# Altium schematic sheet v1.0.SchDoc
size 101 x 76 mm
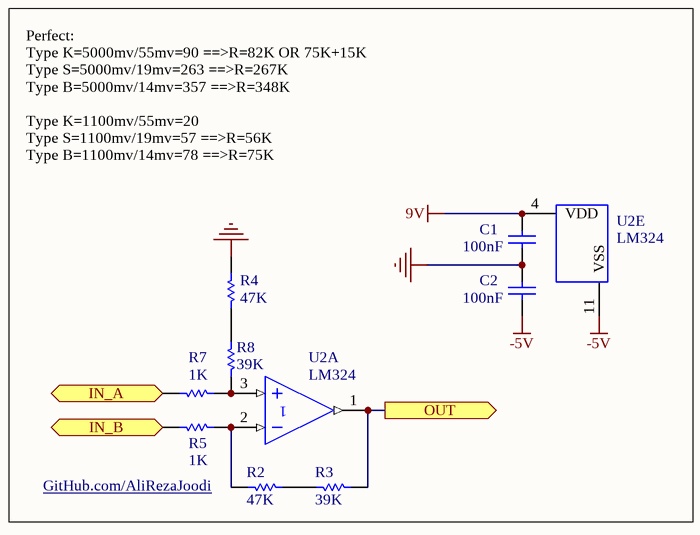
[diagram p0: v1.0.SchDoc]

## Parts
C1  100nF  [CAPNTO2.54-3.05x1.78A]
C2  100nF  [CAPNTO2.54-3.05x1.78A]
R2  47K  [AXIAL-0.4]
R3  39K  [AXIAL-0.4]
R4  47K  [AXIAL-0.4]
R5  1K  [AXIAL-0.4]
R7  1K  [AXIAL-0.4]
R8  39K  [AXIAL-0.4]
U2  LM324  [646-06]  (parts A,E of 5)

## Ports
IN_A (in), IN_B (in), OUT (out)

## Nets
9V: C1.1 U2.4(VDD)
-5V: C2.2 U2.11(VSS)
GND: C1.2 C2.1 R4.2
IN_A: R7.2 ; port IN_A
IN_B: R5.2 ; port IN_B
OUT: R3.2 U2.1(OUT) ; port OUT
NetR2_1: R2.1 R5.1 U2.2(IN-)
NetR2_2: R2.2 R3.1
NetR4_1: R4.1 R8.2
NetR7_1: R7.1 R8.1 U2.3(IN+)

## Notes on the sheet
- Perfect:
  Type K=5000mv/55mv=90 ==>R=82K OR 75K+15K
  Type S=5000mv/19mv=263 ==>R=267K
  Type B=5000mv/14mv=357 ==>R=348K
  Type K=1100mv/55mv=20
  Type S=1100mv/19mv=57 ==>R=56K
  Type B=1100mv/14mv=78 ==>R=75K
- (near R2) GitHub.com/AliRezaJoodi

## Library data of the parts
C1 C2 = Cap: Capacitor; Manufacturer: Generic Components; Class I: Passive; Published: 8-Jun-2000; Revision: July-2002: Re-released for DXP Platform.; Publisher: Altium Limited; Class II: Capacitor
R2-R5 R7 R8 = Res1: Resistor; Published: 8-Jun-2000; LatestRevisionDate: 17-Jul-2002; LatestRevisionNote: Re-released for DXP Platform.; PackageReference: AXIAL-0.3; Publisher: Altium Limited
U2 = LM324: Quad Low-Power Operational Amplifier; Published: 17-Jul-2002; LatestRevisionDate: 06-Jun-2005; LatestRevisionNote: Stylized 3D Model Added.; DatasheetVersion: 1988; PackageVersion: 1997; PackageReference: 646-06; Publisher: Altium Limited; PackageDescription: DIP; 14 Leads; Row Spacing 7.62 mm; Pitch 2.54 mm; ComponentLink1Description: Manufacturer Link; ComponentLink1URL: http://www.onsemi.com/site/products/parametrics/0,4446,251,00.html; ComponentLink2Description: Datasheet; ComponentLink2URL: http://www.onsemi.com/pub/Collateral/LM324-D.PDF